# Altium schematic sheet [4]-Battery.SchDoc
size A4
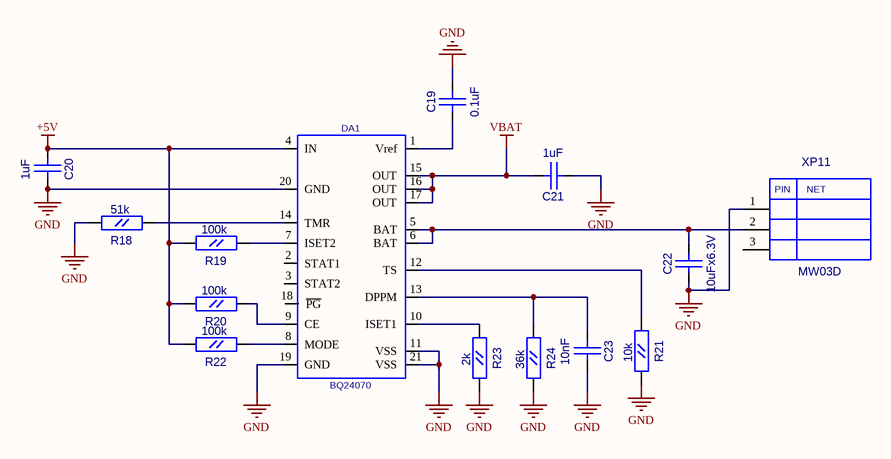
[diagram p0: [4]-Battery.SchDoc]

## Parts
C19  0.1uF  [CC0603]
C20  1uF  [CC0603]
C21  1uF  [CC0603]
C22  10uFx6.3V  [CC0805]
C23  10nF  [CC0603]
DA1  BQ24070  [P-PQFP-N20]
R18  51k  [RC0603]
R19  100k  [RC0603]
R20  100k  [RC0603]
R21  10k  [RC0603]
R22  100k  [RC0603]
R23  2k  [RC0603]
R24  36k  [RC0603]
XP11  MW03D  [MW03D]

## Nets
+5V: C20.1(A) DA1.4(IN) R19.2(B) R20.2(B) R22.2(B)
GND: C19.2(B) C20.2(B) C21.1(A) C22.1(A) C23.2(B) DA1.11(VSS) DA1.19(GND) DA1.20(GND) DA1.21(VSS) R18.2(B) R21.2(B) R23.2(B) R24.2(B) XP11.1
VBAT: C21.2(B) DA1.15(OUT) DA1.16(OUT) DA1.17(OUT)
NetC19_1: C19.1(A) DA1.1(Vref)
NetC22_2: C22.2(B) DA1.5(BAT) DA1.6(BAT) XP11.2
NetC23_1: C23.1(A) DA1.13(DPPM) R24.1(A)
NetDA1_7: DA1.7(ISET2) R19.1(A)
NetDA1_8: DA1.8(MODE) R22.1(A)
NetDA1_9: DA1.9(CE) R20.1(A)
NetDA1_10: DA1.10(ISET1) R23.1(A)
NetDA1_12: DA1.12(TS) R21.1(A)
NetDA1_14: DA1.14(TMR) R18.1(A)

Not connected (* = marked no-connect by the designer): DA1 2(STAT1) 3(STAT2) 18(~{PG}); XP11 3

## Notes on the sheet
- (in symbol MW03D) PIN; NET

## Library data of the parts
C19-C21 C23 = CC0603
  C19: Value: 0.1uF
  C20 C21: Value: 1uF
  C23: Value: 10nF
C22 = CC0805: Value: 10uFx6.3V
R18-R24 = RC0603
  R18: Value: 51k
  R19 R20 R22: Value: 100k
  R21: Value: 10k
  R23: Value: 2k
  R24: Value: 36k
DA1 = BQ24070: Value: *
XP11 = MW03D: Value: *